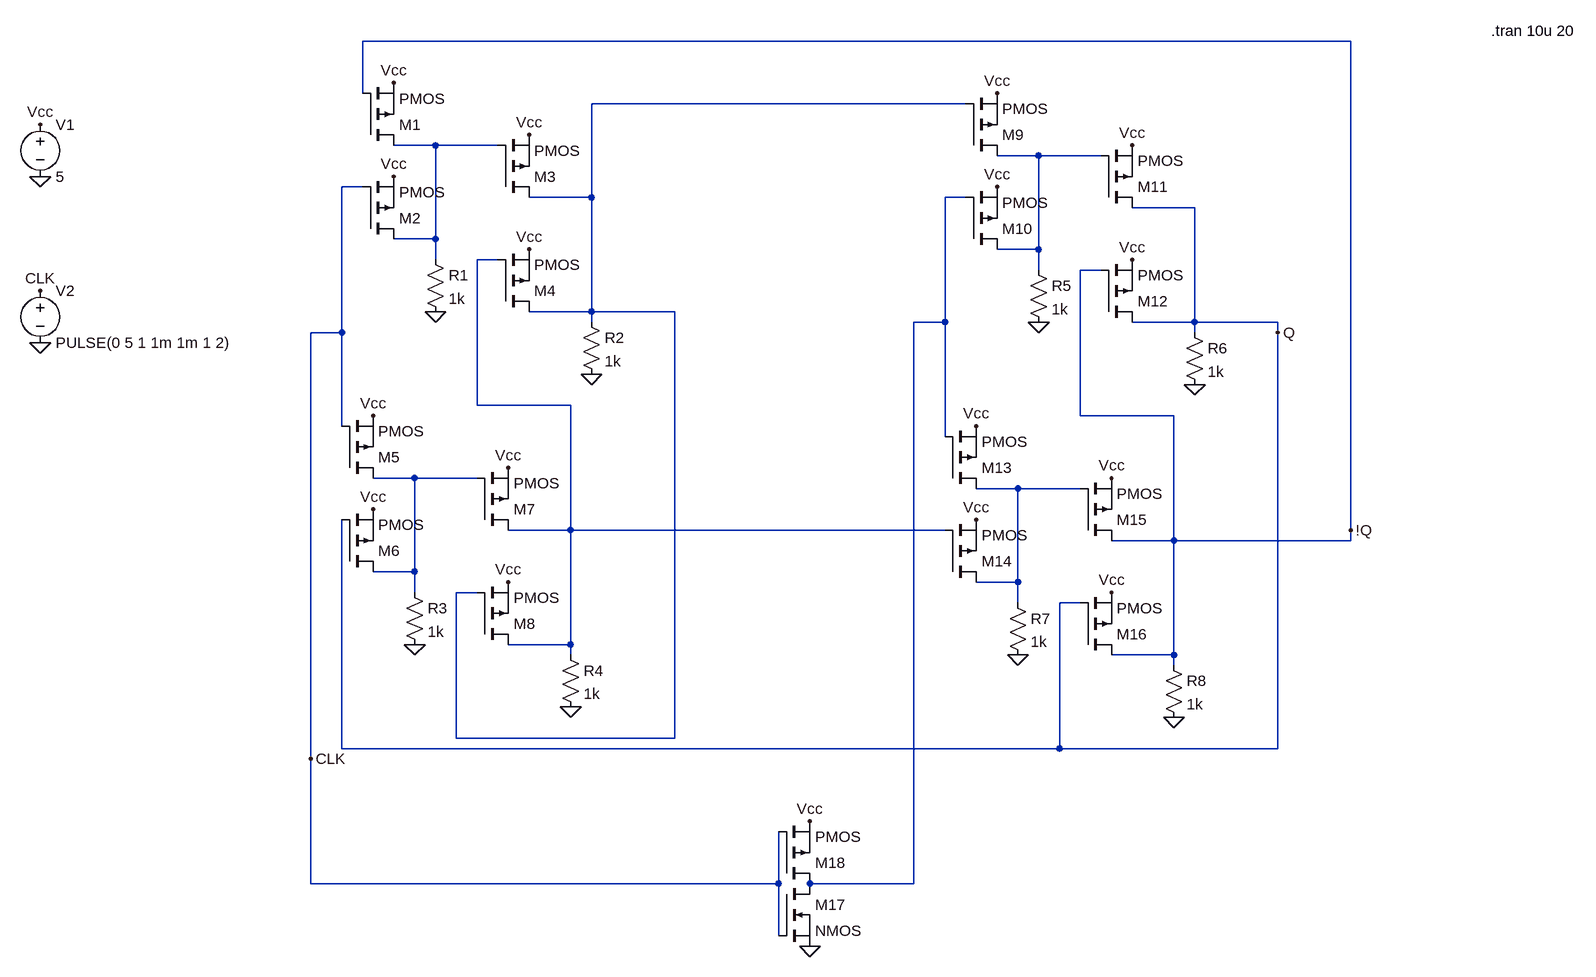
[diagram p0: schematic pmos-res-not-working.asc]
pmos-res-not-working.asc, the LTspice schematic file:
Version 4
SHEET 1 1940 1424
WIRE 1584 16 64 16
WIRE 64 96 64 16
WIRE 992 112 416 112
WIRE 176 176 112 176
WIRE 272 176 176 176
WIRE 1104 192 1040 192
WIRE 1200 192 1104 192
WIRE 64 240 32 240
WIRE 416 256 416 112
WIRE 416 256 320 256
WIRE 992 256 960 256
WIRE 1344 272 1248 272
WIRE 176 320 176 176
WIRE 176 320 112 320
WIRE 1104 336 1104 192
WIRE 1104 336 1040 336
WIRE 176 352 176 320
WIRE 272 352 240 352
WIRE 1104 368 1104 336
WIRE 1200 368 1168 368
WIRE 416 432 416 256
WIRE 416 432 320 432
WIRE 544 432 416 432
WIRE 416 448 416 432
WIRE 960 448 960 256
WIRE 960 448 912 448
WIRE 1344 448 1344 272
WIRE 1344 448 1248 448
WIRE 1472 448 1344 448
WIRE 32 464 32 240
WIRE 32 464 -16 464
WIRE 1344 464 1344 448
WIRE 1472 464 1472 448
WIRE 240 576 240 352
WIRE 384 576 240 576
WIRE 1168 592 1168 368
WIRE 1312 592 1168 592
WIRE 32 608 32 464
WIRE 960 624 960 448
WIRE 144 688 80 688
WIRE 240 688 144 688
WIRE 1072 704 1008 704
WIRE 1168 704 1072 704
WIRE 384 768 384 576
WIRE 384 768 288 768
WIRE 960 768 384 768
WIRE 1584 768 1584 16
WIRE 1312 784 1312 592
WIRE 1312 784 1216 784
WIRE 1584 784 1584 768
WIRE 1584 784 1312 784
WIRE 144 832 144 688
WIRE 144 832 80 832
WIRE 1072 848 1072 704
WIRE 1072 848 1008 848
WIRE 144 864 144 832
WIRE 240 864 208 864
WIRE 1072 880 1072 848
WIRE 1168 880 1136 880
WIRE 384 944 384 768
WIRE 384 944 288 944
WIRE 384 960 384 944
WIRE 1312 960 1312 784
WIRE 1312 960 1216 960
WIRE 1312 976 1312 960
WIRE 208 1088 208 864
WIRE 544 1088 544 432
WIRE 544 1088 208 1088
WIRE 32 1104 32 752
WIRE 1136 1104 1136 880
WIRE 1136 1104 32 1104
WIRE 1472 1104 1472 464
WIRE 1472 1104 1136 1104
WIRE -16 1120 -16 464
WIRE -16 1312 -16 1120
WIRE 704 1312 704 1232
WIRE 704 1312 -16 1312
WIRE 912 1312 912 448
WIRE 912 1312 752 1312
WIRE 704 1392 704 1312
FLAG 176 432 0
FLAG 416 528 0
FLAG 320 336 Vcc
FLAG 320 160 Vcc
FLAG 112 80 Vcc
FLAG 112 224 Vcc
FLAG 144 944 0
FLAG 384 1040 0
FLAG 288 848 Vcc
FLAG 288 672 Vcc
FLAG 80 592 Vcc
FLAG 80 736 Vcc
FLAG 1104 448 0
FLAG 1344 544 0
FLAG 1248 352 Vcc
FLAG 1248 176 Vcc
FLAG 1040 96 Vcc
FLAG 1040 240 Vcc
FLAG 1072 960 0
FLAG 1312 1056 0
FLAG 1216 864 Vcc
FLAG 1216 688 Vcc
FLAG 1008 608 Vcc
FLAG 1008 752 Vcc
FLAG 752 1408 0
FLAG 752 1216 Vcc
FLAG -16 1120 CLK
FLAG 1472 464 Q
FLAG 1584 768 !Q
FLAG -432 224 0
FLAG -432 480 0
FLAG -432 144 Vcc
FLAG -432 400 CLK
SYMBOL pmos 64 176 M180
SYMATTR InstName M1
SYMBOL pmos 64 320 M180
SYMATTR InstName M2
SYMBOL pmos 272 256 M180
SYMATTR InstName M3
SYMBOL pmos 272 432 M180
SYMATTR InstName M4
SYMBOL res 160 336 R0
SYMATTR InstName R1
SYMATTR Value 1k
SYMBOL res 400 432 R0
SYMATTR InstName R2
SYMATTR Value 1k
SYMBOL pmos 32 688 M180
SYMATTR InstName M5
SYMBOL pmos 32 832 M180
SYMATTR InstName M6
SYMBOL pmos 240 768 M180
SYMATTR InstName M7
SYMBOL pmos 240 944 M180
SYMATTR InstName M8
SYMBOL res 128 848 R0
SYMATTR InstName R3
SYMATTR Value 1k
SYMBOL res 368 944 R0
SYMATTR InstName R4
SYMATTR Value 1k
SYMBOL pmos 992 192 M180
SYMATTR InstName M9
SYMBOL pmos 992 336 M180
SYMATTR InstName M10
SYMBOL pmos 1200 272 M180
SYMATTR InstName M11
SYMBOL pmos 1200 448 M180
SYMATTR InstName M12
SYMBOL res 1088 352 R0
SYMATTR InstName R5
SYMATTR Value 1k
SYMBOL res 1328 448 R0
SYMATTR InstName R6
SYMATTR Value 1k
SYMBOL pmos 960 704 M180
SYMATTR InstName M13
SYMBOL pmos 960 848 M180
SYMATTR InstName M14
SYMBOL pmos 1168 784 M180
SYMATTR InstName M15
SYMBOL pmos 1168 960 M180
SYMATTR InstName M16
SYMBOL res 1056 864 R0
SYMATTR InstName R7
SYMATTR Value 1k
SYMBOL res 1296 960 R0
SYMATTR InstName R8
SYMATTR Value 1k
SYMBOL nmos 704 1312 R0
SYMATTR InstName M17
SYMBOL pmos 704 1312 M180
SYMATTR InstName M18
SYMBOL voltage -432 128 R0
SYMATTR InstName V1
SYMATTR Value 5
SYMBOL voltage -432 384 R0
SYMATTR InstName V2
SYMATTR Value PULSE(0 5 1 1m 1m 1 2)
TEXT 1800 0 Left 2 !.tran 10u 20

The netlist it stands for:
* pmos-res-not-working.asc
M1 N002 !Q Vcc Vcc PMOS
M2 N002 CLK Vcc Vcc PMOS
M3 N001 N002 Vcc Vcc PMOS
M4 N001 N005 Vcc Vcc PMOS
R1 N002 0 1k
R2 N001 0 1k
M5 N006 CLK Vcc Vcc PMOS
M6 N006 Q Vcc Vcc PMOS
M7 N005 N006 Vcc Vcc PMOS
M8 N005 N001 Vcc Vcc PMOS
R3 N006 0 1k
R4 N005 0 1k
M9 N003 N001 Vcc Vcc PMOS
M10 N003 N004 Vcc Vcc PMOS
M11 Q N003 Vcc Vcc PMOS
M12 Q !Q Vcc Vcc PMOS
R5 N003 0 1k
R6 Q 0 1k
M13 N007 N004 Vcc Vcc PMOS
M14 N007 N005 Vcc Vcc PMOS
M15 !Q N007 Vcc Vcc PMOS
M16 !Q Q Vcc Vcc PMOS
R7 N007 0 1k
R8 !Q 0 1k
M17 N004 CLK 0 0 NMOS
M18 N004 CLK Vcc Vcc PMOS
V1 Vcc 0 5
V2 CLK 0 PULSE(0 5 1 1m 1m 1 2)
.model NMOS NMOS
.model PMOS PMOS
.lib standard.mos
.tran 10u 20
.backanno
.end